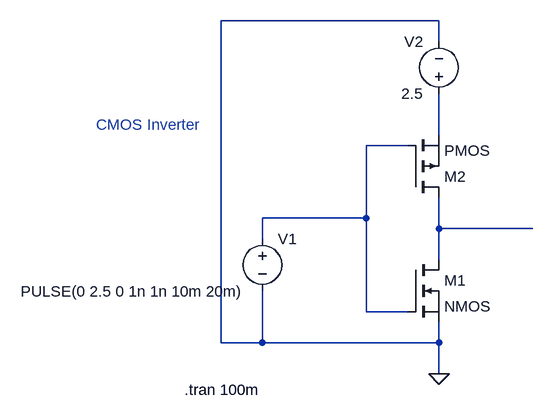
[diagram p0: schematic Cmos inverter.asc]
Cmos inverter.asc, the LTspice schematic file:
Version 4
SHEET 1 880 680
WIRE 224 -208 -112 -208
WIRE 224 -176 224 -208
WIRE 224 -32 224 -96
WIRE 176 -16 112 -16
WIRE 112 96 112 -16
WIRE 112 96 -48 96
WIRE 224 112 224 64
WIRE 368 112 224 112
WIRE -48 128 -48 96
WIRE 224 160 224 112
WIRE 112 240 112 96
WIRE 176 240 112 240
WIRE -112 288 -112 -208
WIRE -48 288 -48 208
WIRE -48 288 -112 288
WIRE 224 288 224 256
WIRE 224 288 -48 288
WIRE 224 336 224 288
FLAG 224 336 0
SYMBOL nmos 176 160 R0
SYMATTR InstName M1
SYMBOL voltage -48 112 R0
WINDOW 3 -372 97 Left 2
WINDOW 123 0 0 Left 0
WINDOW 39 0 0 Left 0
SYMATTR InstName V1
SYMATTR Value PULSE(0 2.5 0 1n 1n 10m 20m)
SYMBOL voltage 224 -80 R180
WINDOW 0 24 96 Left 2
WINDOW 3 24 16 Left 2
WINDOW 123 0 0 Left 0
WINDOW 39 0 0 Left 0
SYMATTR InstName V2
SYMATTR Value 2.5
SYMBOL pmos 176 64 M180
SYMATTR InstName M2
TEXT -168 360 Left 2 !.tran 100m
TEXT -304 -48 Left 2 ;CMOS Inverter

The netlist it stands for:
* Cmos inverter.asc
M1 N003 N002 0 0 NMOS
V1 N002 0 PULSE(0 2.5 0 1n 1n 10m 20m)
V2 N001 0 2.5
M2 N003 N002 N001 N001 PMOS
.model NMOS NMOS
.model PMOS PMOS
.lib standard.mos
.tran 100m
* CMOS Inverter
.backanno
.end